# EAGLE design SAS_rev04 (EAGLE 7.5.0)

## Sheet 1 of 2
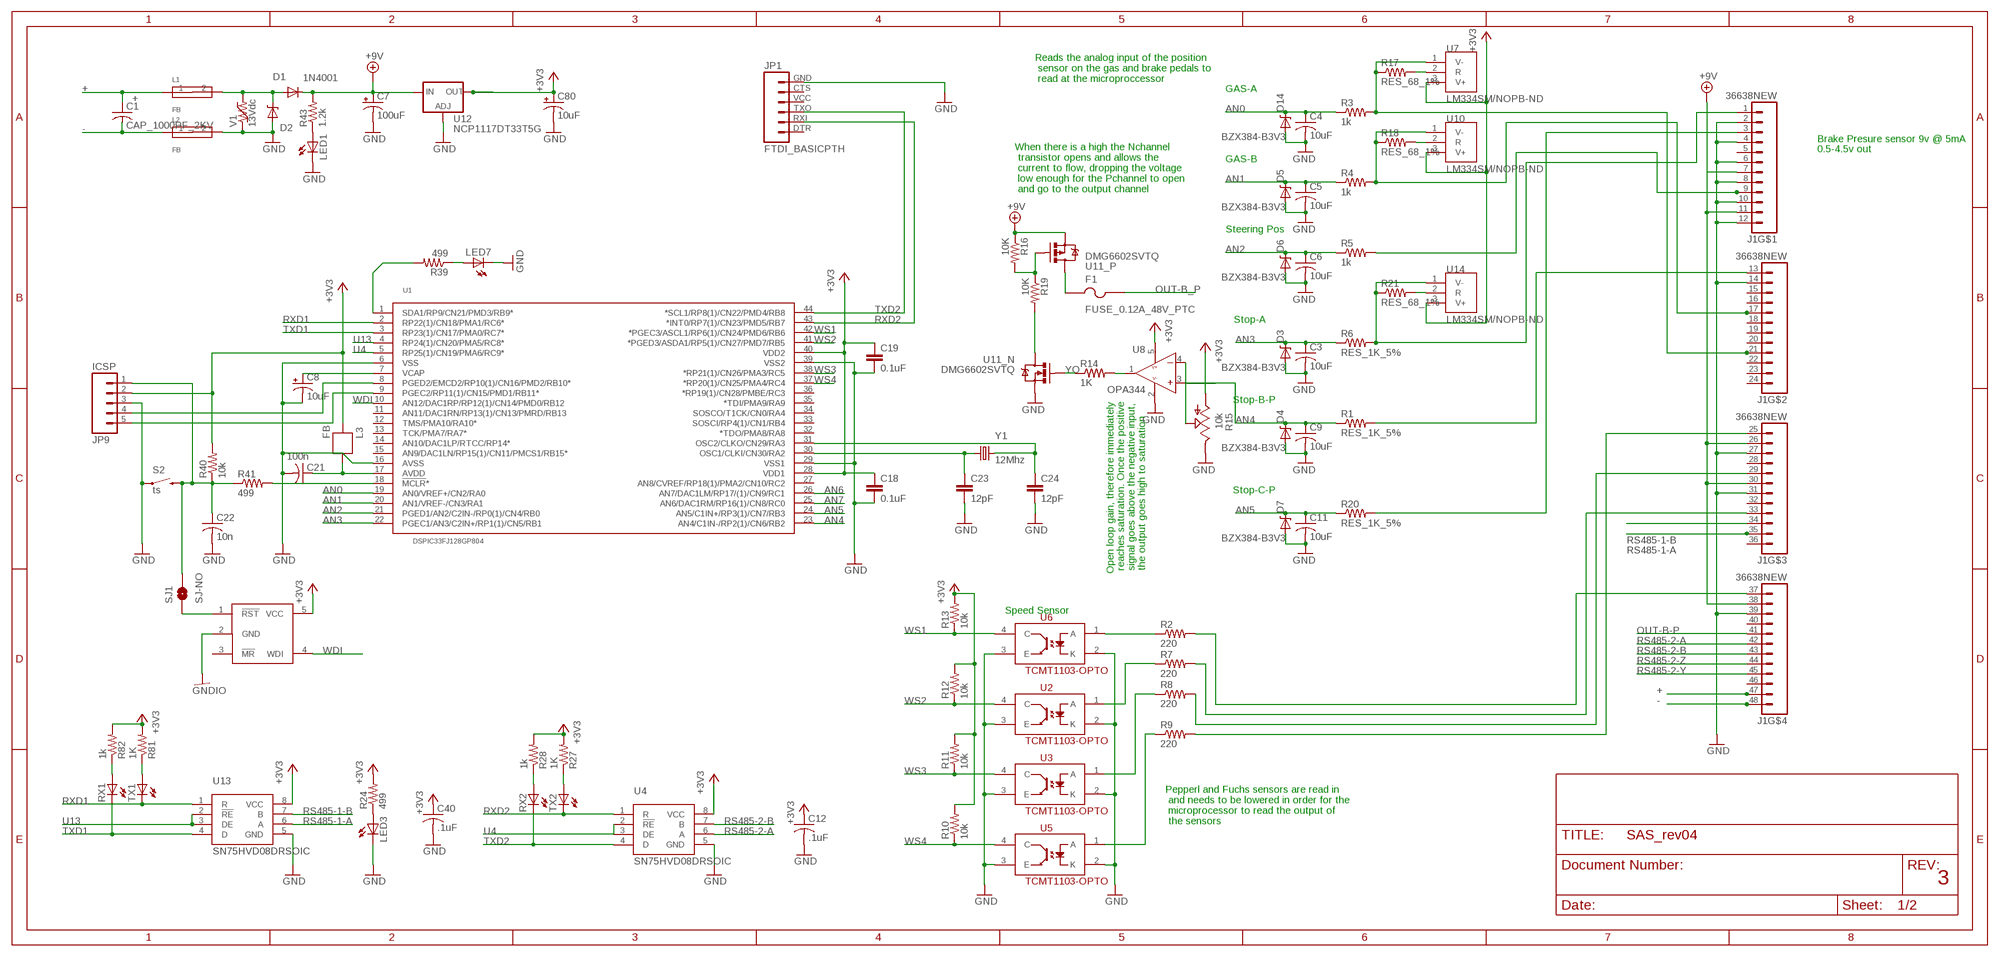
[diagram p0: schematic, sheet 1]

### Parts
C1  CAP_1000PF_2KV  [C1825]
C3  10uF  C-USC0805  [C0805]
C4  10uF  C-USC0805  [C0805]
C5  10uF  C-USC0805  [C0805]
C6  10uF  C-USC0805  [C0805]
C7  100uF  CAP_POL7343  [EIA7343]
C8  10uF  CAP-POL_10UF_16V  [EIA3216-16V]
C9  10uF  C-USC0805  [C0805]
C11  10uF  C-USC0805  [C0805]
C12  .1uF  CAP_0.1UF_50V  [0603]
C18  0.1uF  CAP0805  [0805]
C19  0.1uF  CAP0805  [0805]
C21  100n  C-USC0805  [C0805]
C22  10n  CAP_10NF_50V  [0603]
C23  12pF  CAP0805  [0805]
C24  12pF  CAP0805  [0805]
C40  .1uF  CAP_0.1UF_50V  [0603]
C80  10uF  POLCAP  [POLC1206]
D1  1N4001  DIODE-SOD123  [SOD123]
D2  MM5Z30  [SOD-523F]
D3  BZX384-B3V3  DIODE-ZENER-BZT52  [SOD-323]
D4  BZX384-B3V3  DIODE-ZENER-BZT52  [SOD-323]
D5  BZX384-B3V3  DIODE-ZENER-BZT52  [SOD-323]
D6  BZX384-B3V3  DIODE-ZENER-BZT52  [SOD-323]
D7  BZX384-B3V3  DIODE-ZENER-BZT52  [SOD-323]
D14  BZX384-B3V3  DIODE-ZENER-BZT52  [SOD-323]
F1  FUSE_0.12A_48V_PTC  [1206]
J1  36638NEW  [36638-M]
JP1  FTDI_BASICPTH  [FTDI_BASIC]
JP9  ICSP  M05LOCK_LONGPADS  [1X05_LOCK_LONGPADS]
L1  FB  FERITEBEAD  [0603]
L2  FB  FERITEBEAD  [0603]
L3  FB  [0603]
LED1  LEDCHIP-LED0805  [CHIP-LED0805]
LED3  LEDCHIP-LED0805  [CHIP-LED0805]
LED7  LEDCHIP-LED0805  [CHIP-LED0805]
R1  RES_1K_5%  [0603]
R2  220  RES_220_1%  [0603]
R3  1k  RES_1K_5%  [0603]
R4  1k  RES_1K_5%  [0603]
R5  1k  RES_1K_5%  [0603]
R6  RES_1K_5%  [0603]
R7  220  RES_220_1%  [0603]
R8  220  RES_220_1%  [0603]
R9  220  RES_220_1%  [0603]
R10  10k  RES_10K_1%  [0603]
R11  10k  RES_10K_1%  [0603]
R12  10k  RES_10K_1%  [0603]
R13  10k  RES_10K_1%  [0603]
R14  1K  RES_1K_1%_0805  [0805]
R15  10k  POT_10K_POT  [PVG3]
R16  10K  RES_10K_1%_0805  [0805]
R17  RES_68_1%  [0603]
R18  RES_68_1%  [0603]
R19  10K  RES_10K_1%_0805  [0805]
R20  RES_1K_5%  [0603]
R21  RES_68_1%  [0603]
R24  499  RES_499_1%  [0603]
R27  1K  RES_1K_1%_0805  [0805]
R28  1k  RES_1K_1%_0805  [0805]
R39  499  RES_499_1%  [0603]
R40  10k  RES_10K_1%_0805  [0805]
R41  499  RES_499_1%_0805  [0805]
R43  1.2k  RES_1.2K_1%_0805  [0805]
R81  1K  RES_1K_5%  [0603]
R82  1k  RES_1K_5%  [0603]
RX1  LEDCHIPLED_0805  [CHIPLED_0805]
RX2  LEDCHIPLED_0805  [CHIPLED_0805]
S2  ts  SWITCH-MOMENTARY-2PTH  [TACTILE-PTH]
SJ1  SJ-NO  SOLDERJUMPERNO  [SJ_2S-NO]
TX1  LEDCHIPLED_0805  [CHIPLED_0805]
TX2  LEDCHIPLED_0805  [CHIPLED_0805]
U1  DSPIC33FJ128GP804  [TQFP-44]
U2  TCMT1103-OPTO  [SSOP-4]
U3  TCMT1103-OPTO  [SSOP-4]
U4  SN75HVD08DRSOIC  [SO-8]
U5  TCMT1103-OPTO  [SSOP-4]
U6  TCMT1103-OPTO  [SSOP-4]
U7  LM334SM/NOPB-ND  [SO-8]
U8  OPA344  [SOT23-5]
U9  MAX823  [SOT23-5L]
U10  LM334SM/NOPB-ND  [SO-8]
U11  DMG6602SVTQ  [SOT23-6]
U12  NCP1117DT33T5G  V_REG_317DPACK  [V-REG_DPACK]
U13  SN75HVD08DRSOIC  [SO-8]
U14  LM334SM/NOPB-ND  [SO-8]
V1  13Vdc  VAR-RES  [0603]
Y1  12Mhz  CRYSTAL5X3  [CRYSTAL-SMD-5X3]

### Nets
+: C1.1(+) J1.47 L1.1
+3V3: C12.1(+) C18.1 C19.1 C40.1(+) C80.1(+) JP9.2 L3.2 R10.2 R11.2 R12.2 R13.2 R15.1(CW) R24.2 R27.2 R28.2 R40.2 R81.2 R82.2 U1.28(VDD1) U1.40(VDD2) U4.8(VCC) U7.3(V+) U8.5(V+) U9.5(VCC) U10.3(V+) U12.4(OUT) U13.8(VCC) U14.3(V+)
+9V: C7.A(+) D1.C J1.7 J1.11 J1.26 J1.30 J1.38 R16.1 R43.2 U11.2(_P:S) U12.3(IN)
-: C1.2(-) J1.48 L2.1
AN0: C4.1 D14.1(C) R3.1 U1.19(AN0/VREF+/CN2/RA0)
AN1: C5.1 D5.1(C) R4.1 U1.20(AN1/VREF-/CN3/RA1)
AN2: C6.1 D6.1(C) R5.1 U1.21(PGED1/AN2/C2IN-/RP0(1)/CN4/RB0)
AN3: C3.1 D3.1(C) R6.1 U1.22(PGEC1/AN3/C2IN+/RP1(1)/CN5/RB1)
AN4: C9.1 D4.1(C) R1.1 U1.23(AN4/C1IN-/RP2(1)/CN6/RB2) U8.3(+)
AN5: C11.1 D7.1(C) R20.1 U1.24(AN5/C1IN+/RP3(1)/CN7/RB3)
AN6: U1.26(AN7/DAC1LM/RP17/(1)/CN9/RC1)
AN7: U1.25(AN6/DAC1RM/RP16(1)/CN8/RC0)
GHT: D1.A D2.C L1.2 V1.2
GND: C3.2 C4.2 C5.2 C6.2 C7.C(-) C8.C(-) C9.2 C11.2 C12.2(-) C18.2 C19.2 C21.2 C22.2(-) C23.2 C24.2 C40.2(-) C80.2(-) D2.A D3.2(A) D4.2(A) D5.2(A) D6.2(A) D7.2(A) D14.2(A) J1.2 J1.4 J1.6 J1.8 J1.10 J1.12 J1.14 J1.27 J1.31 J1.39 JP1.GND JP9.3 L2.2 LED1.C LED3.C LED7.C R15.3(CCW) S2.1 U1.6(VSS) U1.16(AVSS) U1.29(VSS1) U1.39(VSS2) U2.2(K) U2.3(E) U3.2(K) U3.3(E) U4.5(GND) U5.2(K) U5.3(E) U6.2(K) U6.3(E) U8.2(V-) U11.5(_N:S) U12.1(ADJ) U13.5(GND) V1.1
GNDIO: U9.2(GND)
N$1: C22.1(+) JP9.1 R40.1 R41.1 S2.3 SJ1.2
N$2: C21.1 L3.1 U1.17(AVDD)
N$3: J1.21 R3.2 R17.1 U7.1(V-)
N$4: C8.A(+) U1.7(VCAP)
N$5: R39.2 U1.1(SDA1/RP9/CN21/PMD3/RB9*)
N$6: LED1.A R43.1
N$7: R17.2 U7.2(R)
N$8: R41.2 U1.18(!MCLR!*)
N$9: R15.2(W) U8.4(-)
N$10: SJ1.1 U9.1(!RST)
N$11: J1.37 R2.2
N$12: JP9.4 U1.8(PGED2/EMCD2/RP10(1)/CN16/PMD2/RB10*)
N$15: JP9.5 U1.9(PGEC2/RP11(1)/CN15/PMD1/RB11*)
N$16: J1.33 R7.2
N$17: J1.29 R8.2
N$18: J1.25 R9.2
N$19: R2.1 U6.1(A)
N$20: R7.1 U2.1(A)
N$21: R8.1 U3.1(A)
N$22: R9.1 U5.1(A)
N$24: R18.2 U10.2(R)
N$25: LED3.A R24.1
N$28: J1.17 R4.2 R18.1 U10.1(V-)
N$29: J1.9 R5.2
N$31: R27.1 TX2.A
N$32: R28.1 RX2.A
N$34: R14.2 U8.1(O)
N$37: LED7.A R39.1
N$39: C24.1 U1.31(OSC2/CLKO/CN29/RA3) Y1.3
N$40: C23.1 U1.30(OSC1/CLKI/CN30/RA2) Y1.1
N$42: R19.2 U11.6(_N:D)
N$44: R16.2 R19.1 U11.3(_P:G)
N$45: F1.1 U11.4(_P:D)
N$50: R21.2 U14.2(R)
N$86: R81.1 TX1.A
N$87: R82.1 RX1.A
OUT-B-P: J1.41
OUT-B_P: F1.2
RS485-1-A: J1.35 U13.6(A)
RS485-1-B: J1.34 U13.7(B)
RS485-2-A: J1.42 U4.6(A)
RS485-2-B: J1.43 U4.7(B)
RS485-2-Y: J1.45
RS485-2-Z: J1.44
RXD1: TX1.C U1.2(RP22(1)/CN18/PMA1/RC6*) U13.1(R)
RXD2: JP1.RXI TX2.C U1.43(*INT0/RP7(1)/CN23/PMD5/RB7) U4.1(R)
STOP-A: J1.1 R6.2 R21.1 U14.1(V-)
STOP-B: J1.13 R1.2
STOP-C: J1.3 R20.2
TXD1: RX1.C U1.3(RP23(1)/CN17/PMA0/RC7*) U13.4(D)
TXD2: JP1.TXO RX2.C U1.44(*SCL1/RP8(1)/CN22/PMD4/RB8) U4.4(D)
U4: U1.5(RP25(1)/CN19/PMA6/RC9*) U4.2(!RE) U4.3(DE)
U13: U1.4(RP24(1)/CN20/PMA5/RC8*) U13.2(!RE) U13.3(DE)
WDI: U1.10(AN12/DAC1RP/RP12(1)/CN14/PMD0/RB12) U9.4(WDI)
WS1: R13.1 U1.42(*PGEC3/ASCL1/RP6(1)/CN24/PMD6/RB6) U6.4(C)
WS2: R12.1 U1.41(*PGED3/ASDA1/RP5(1)/CN27/PMD7/RB5) U2.4(C)
WS3: R11.1 U1.38(*RP21(1)/CN26/PMA3/RC5) U3.4(C)
WS4: R10.1 U1.37(*RP20(1)/CN25/PMA4/RC4) U5.4(C)
YO: R14.1 U11.1(_N:G)
Unconnected: J1.5 J1.15 J1.16 J1.18 J1.19 J1.20 J1.22 J1.23 J1.24 J1.28 J1.32 J1.36 J1.40 J1.46 JP1.CTS JP1.DTR JP1.VCC U1.11(AN11/DAC1RN/RP13(1)/CN13/PMRD/RB13) U1.12(TMS/PMA10/RA10*) U1.13(TCK/PMA7/RA7*) U1.14(AN10/DAC1LP/RTCC/RP14*) U1.15(AN9/DAC1LN/RP15(1)/CN11/PMCS1/RB15*) U1.27(AN8/CVREF/RP18(1)/PMA2/CN10/RC2) U1.32(*TDO/PMA8/RA8) U1.33(SOSCI/RP4(1)/CN1/RB4) U1.34(SOSCO/T1CK/CN0/RA4) U1.35(*TDI/PMA9/RA9) U1.36(*RP19(1)/CN28/PMBE/RC3) U9.3(!MR)

### Notes on the sheet
- Reads the analog input of the position
   sensor on the gas and brake pedals to
   read at the microproccessor
- GAS-A
- Brake Presure sensor 9v @ 5mA
- 0.5-4.5v out
- GAS-B
- When there is a high the Nchannel
   transistor opens and allows the
   current to flow, dropping the voltage
   low enough for the Pchannel to open
   and go to the output channel
- Steering Pos
- Stop-A
- Stop-B-P
- Stop-C-P
- Open loop gain, therefore immediately
   reaches saturation. Once the positive
   signal goes above the negative input,
   the output goes high to saturation
- Speed Sensor
- Pepperl and Fuchs sensors are read in
   and needs to be lowered in order for the
   microprocessor to read the output of
   the sensors
- 3

## Sheet 2 of 2

## Library data of the parts
C1 = FSAE Electric:CAP; PARTNO: 1825GC102KAT1A
C3-C6 C9 C11 C21 = adafruit:C-US: CAPACITOR, American symbol
C7 = SparkFun-Capacitors:CAP_POL: Capacitor Polarized These are standard SMD and PTH capacitors. Normally 10uF, 47uF, and 100uF in electrolytic and tantalum varieties. Always verify the external diameter of the through hole cap, it varies with capacity, voltage, and manufacturer. The EIA devices should be standard.
C8 = FSAE Electric:CAP-POL; PARTNO: T491A106M016AT
C12 C40 = FSAE Electric:CAP; PARTNO: CC0603ZRY5V9BB104
C18 C19 C23 C24 = SparkFun-Capacitors:CAP: Capacitor Standard 0603 ceramic capacitor, and 0.1" leaded capacitor.
C22 = FSAE Electric:CAP; PARTNO: CL10F103ZB8NNNC
C80 = RJ's_parts:POLCAP
D1 = diode:DIODE-: DIODE
D2 = EmEndev:MM5Z30
D3-D7 D14 = SparkFun:DIODE-ZENER: Zener Diode Production Part - 8199 3.4V Zener Voltage
F1 = FSAE Electric:FUSE; PARTNO: 0ZCJ0012FF2E
J1 = FSAE Electric:36638
JP1 = SparkFun-Connectors:FTDI_BASIC: FTDI Basic header with labels
JP9 = SparkFun-Connectors:M05: Header 5 Standard 5-pin 0.1" header. Use with straight break away headers (SKU : PRT-00116), right angle break away headers (PRT-00553), swiss pins (PRT-00743), machine pins (PRT-00117), and female headers (PRT-00115). Molex polarized connector foot print use with SKU : PRT-08230 with associated crimp pins and housings.
L1 L2 = EmEndev:FERITEBEAD
L3 = SparkFun-Passives:FB
LED1 LED3 LED7 RX1 RX2 TX1 TX2 = adafruit:LED: LED OSRAM: - CHIPLED LG R971, LG N971, LY N971, LG Q971, LY Q971, LO R971, LY R971 LH N974, LH R974 LS Q976, LO Q976, LY Q976 LO Q996 - Hyper CHIPLED LW Q18S LB Q993, LB Q99A, LB R99A - SideLED LS A670, LO A670, LY A670, LG A670, LP A670 LB A673, LV A673, LT A673, LW A673 LH A674 LY A675 LS A676, LA A676, LO A676, LY A676, LW A676 LS A679, LY A679, LG A679 - Hyper Micro SIDELED® LS Y876, LA Y876, LO Y876, LY Y876 LT Y87S - SmartLED LW L88C, LW L88S LB L89C, LB L89S, LG L890 LS L89K, LO L89K, LY L89K LS L896, LA L896, LO L896, LY L896 - TOPLED LS T670, LO T670, LY T670, LG T670, LP T670 LSG T670, LSP T670, LSY T670, LOP T670, LYG T670 LG T671, LOG T671, LSG T671 LB T673, LV T673, LT T673, LW T673 LH T674 LS T676, LA T676, LO T676, LY T676, LB T676, LH T676, LSB T676, LW T676 LB T67C, LV T67C, LT T67C, LS T67K, LO T67K, LY T67K, LW E67C LS E67B, LA E67B, LO E67B, LY E67B, LB E67C, LV E67C, LT E67C LW T67C LS T679, LY T679, LG T679 LS T770, LO T770, LY T770, LG T770, LP T770 LB T773, LV T773, LT T773, LW T773 LH T774 LS E675, LA E675, LY E675, LS T675 LS T776, LA T776, LO T776, LY T776, LB T776 LHGB T686 LT T68C, LB T68C - Hyper Mini TOPLED® LB M676 - Mini TOPLED Santana® LG M470 LS M47K, LO M47K, LY M47K Source: http://www.osram.convergy.de/
R1 R3-R6 R20 R81 R82 = FSAE Electric:RES: Resistors; PARTNO: RC0603JR-071KL
R2 R7-R9 = FSAE Electric:RES: Resistors; PARTNO: RC0603FR-07220RL
R10-R13 = FSAE Electric:RES: Resistors; PARTNO: RC0603FR-0710KL
R14 = FSAE Electric:RES: Resistors; PARTNO: RC0805FR-071KL
R15 = FSAE Electric:POT; PARTNO: PVG3A103C01R00
R16 R19 = FSAE Electric:RES: Resistors; PARTNO: RC0805FR-0710KL
R17 R18 R21 = FSAE Electric:RES: Resistors; PARTNO: CRCW060368R0FKEA
R24 R39 = FSAE Electric:RES: Resistors; PARTNO: RC0603FR-07499RL
R27 R28 = FSAE Eletric:RES; PARTNO: RC0805FR-071KL
R40 = FSAE Eletric:RES; PARTNO: RC0805FR-0710KL
R41 = FSAE Eletric:RES; PARTNO: RC0805FR-07499RL
R43 = FSAE Electric:RES: Resistors; PARTNO: RC0805FR-071K2L
S2 = SparkFun-Electromechanical:SWITCH-MOMENTARY-2: Various NO switches- pushbuttons, reed, etc
SJ1 = SparkFun-Passives:SOLDERJUMPER: Solder Jumper Standard SMD solder jumper. Used to automate production. Two varients : Normally Open and Normally Closed are the same, but have different paste layers. NC will have a large amount of paste and should jumper during reflow.
U1 = FSAE Electric:DSPIC33FJ128GP804; PARTNO: DSPIC33FJ128GP804-I/PT
U2 U3 U5 U6 = SparkFun-DiscreteSemi:TCMT1103-OPTO: Optoisolator- NPN output
U4 U13 = FSAE Electric:SN75HVD08DR; PARTNO: SN75176BDR
U7 U10 U14 = FSAE Electric:LM334: Current Source IC 3% 8-SO View on DigiKey <http://www.digikey.com/product-detail/en/LM334SM%2FNOPB/LM334SM%2FNOPB-ND/363905>; PARTNO: LM334SM/NOPB-ND
U8 = FSAE Electric:OPA344; PARTNO: OPA344NA/3K
U9 = NASA_LIB:MAX823
U11 = FSAE Electric:DMG6602SVTQ: DMG6602SVTQ-7 MOSFET N/P-CH 30V; PARTNO: DMG6602SVTQ-7
U12 = SparkFun-PowerIC:V_REG_317: Voltage Regulator Standard LM317 adjustable voltage regulator. AOI (Adjust Output Input). Google 'LM317 Calculator' for easy to use app to get the two resistor values needed. 240/720 for 5V output. 240/390 for 3.3V output. Spark Fun Electronics SKU : COM-00527
V1 = EmEndev:VAR-RES
Y1 = SparkFun-FreqCtrl:CRYSTAL: Various standard crystals. Proven footprints. Spark Fun Electronics SKU : COM-00534

## Board
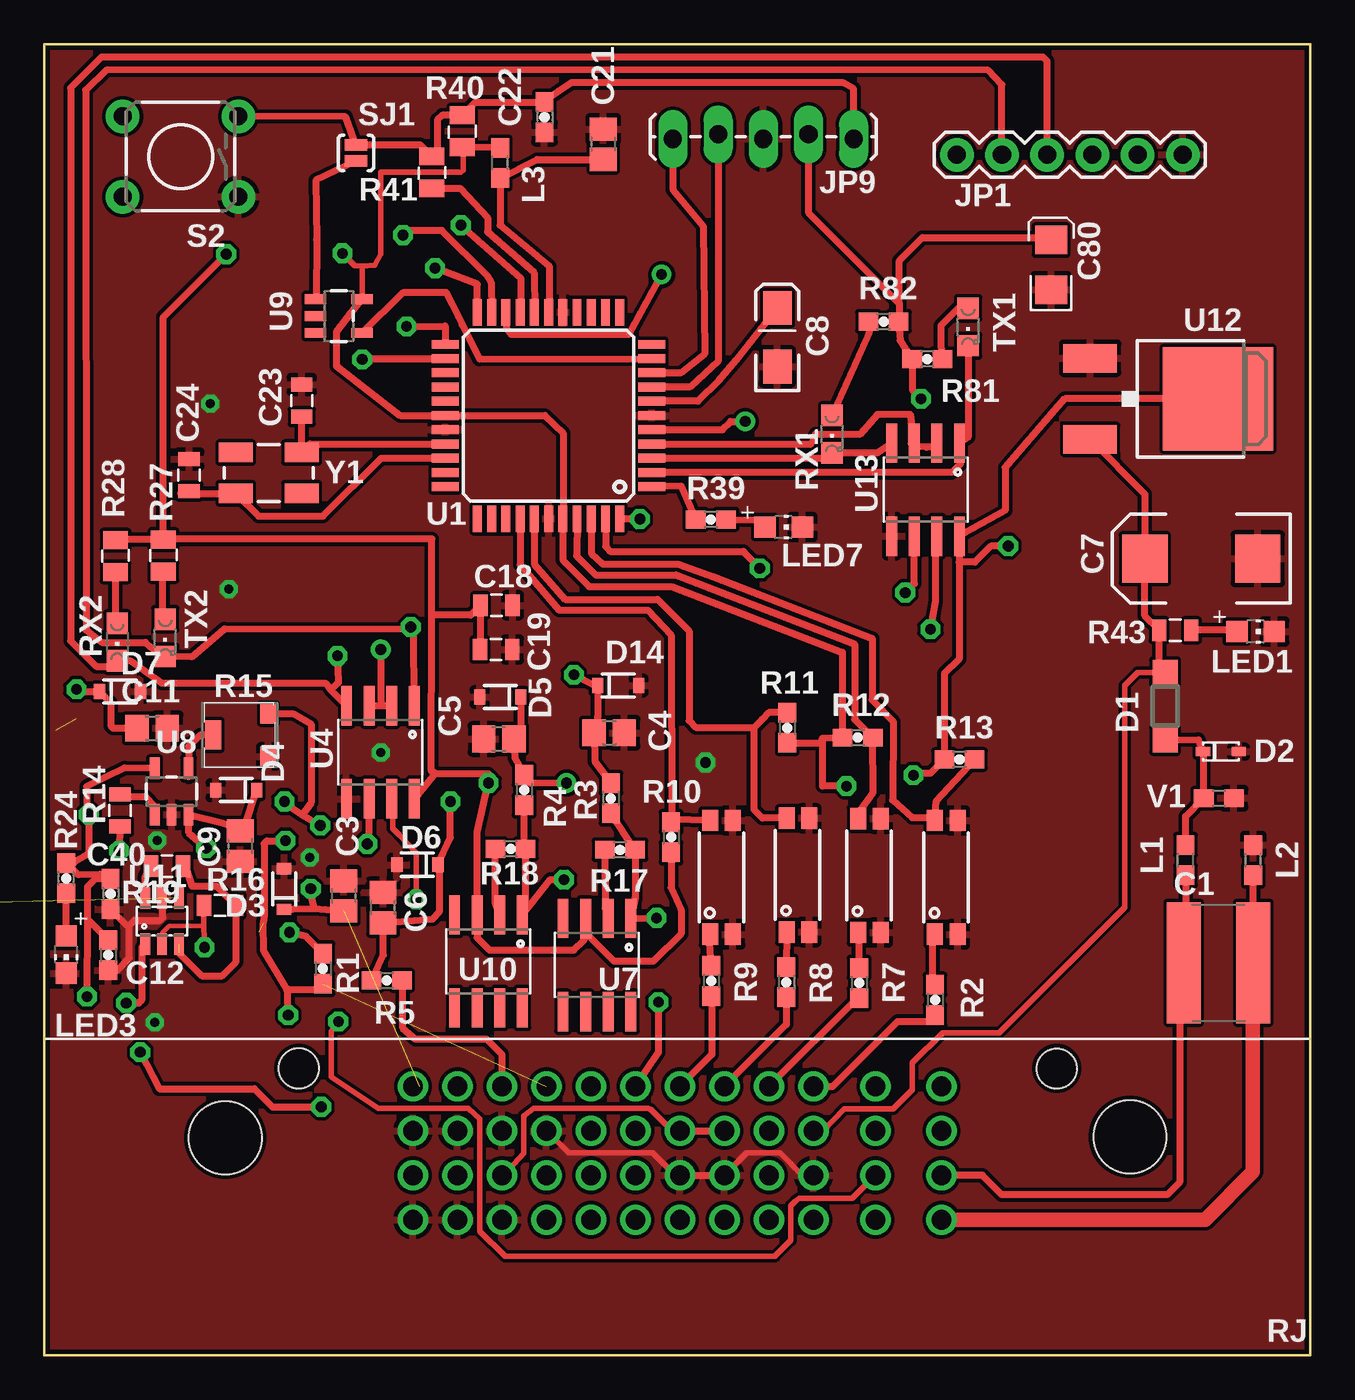
[diagram p1: board, top side]
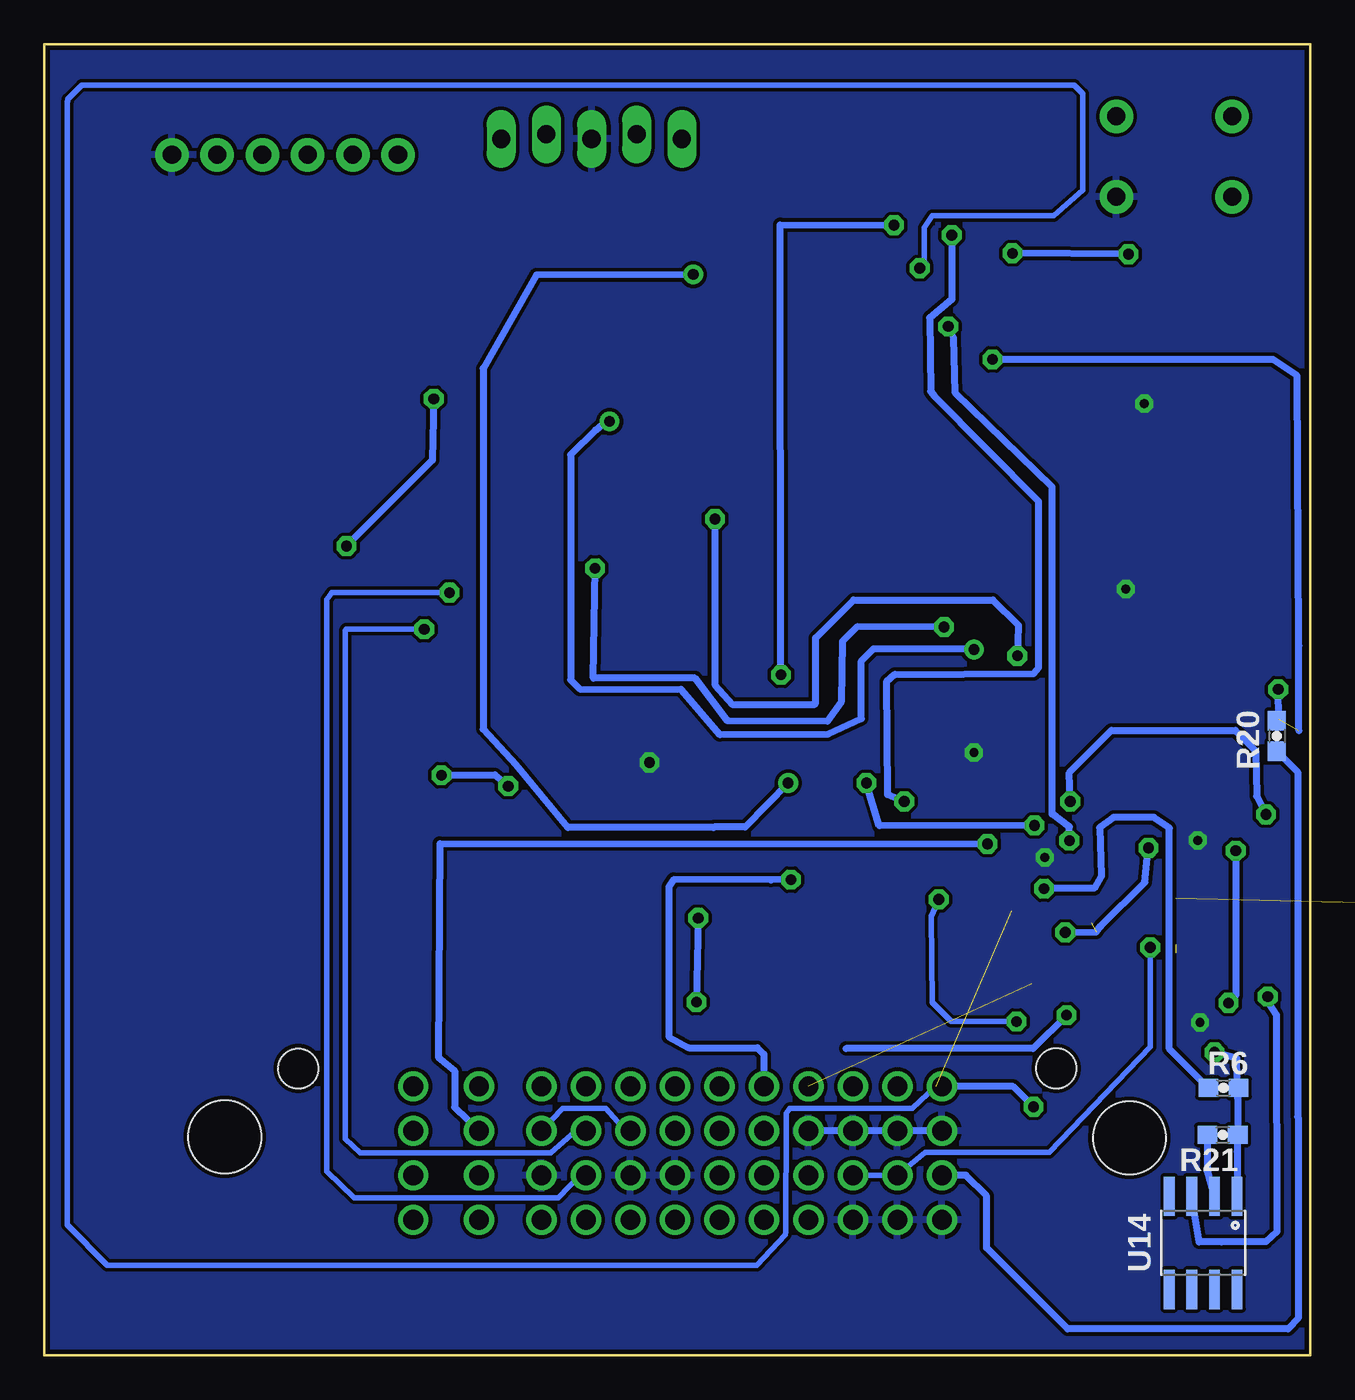
[diagram p2: board, bottom side, seen from below]

Size 71.12 x 73.66 mm. Coordinates in mm from the lower left corner, seen from the top.
Copper layers (1*16): Top 0.035mm / dielectric 1.5mm / Bottom 0.035mm
Design rules "SparkFun": minimum track width 8mil, minimum drill 20mil, track to track 8mil, track to pad 8mil, pad to pad 8mil, via to via 8mil, smd to smd 8mil, copper to edge 10mil, drill to drill 8mil, minimum pad ring 12mil, minimum via ring 10mil, stop-mask expansion 4mil, vias tented up to drill 25mil, thermal gap 10mil

### Footprints (pad centres in the part's own frame; a part is rotated, then mirrored left to right if it is on the bottom)
C1825 = smd 6.8 x 1.9: 1 0,-1.95; 2 0,1.95
C0805 = smd 1.3 x 1.5: 1 -0.85,0; 2 0.85,0
EIA7343 = smd 2.55 x 2.7: A 3.17,0; C -3.17,0
EIA3216-16V = smd 1.9 x 1.6: A 1.65,0; C -1.65,0
0603 = smd 1.1 x 1: 1 -0.85,0; 2 0.85,0
0805 = smd 0.8 x 1.2: 1 -0.9,0; 2 0.9,0
POLC1206 = smd 1.6 x 1.8: 1 -1.4,0; 2 1.4,0
SOD123 = smd 1.4 x 1.4: A 1.9,0; C -1.9,0
SOD-523F = smd 0.8 x 0.5: A -1,0; C 1,0
SOD-323 = smd 0.63 x 0.83: 1 -1.15,0; 2 1.15,0
1206 = smd 1.6 x 1.8: 1 -1.4,0; 2 1.4,0
36638-M = drill 1.1: 1 20.7,15.1; 2 20.7,12.6; 3 20.7,10.1; 4 20.7,7.6; 5 23.2,15.1; 6 23.2,12.6; 7 23.2,10.1; 8 23.2,7.6; 9 25.7,15.1; 10 25.7,12.6; 11 25.7,10.1; 12 25.7,7.6; 13 28.2,15.1; 14 28.2,12.6; 15 28.2,10.1; 16 28.2,7.6; 17 30.7,15.1; 18 30.7,12.6; 19 30.7,10.1; 20 30.7,7.6; 21 33.2,15.1; 22 33.2,12.6; 23 33.2,10.1; 24 33.2,7.6; 25 35.7,15.1; 26 35.7,12.6; 27 35.7,10.1; 28 35.7,7.6; 29 38.2,15.1; 30 38.2,12.6; 31 38.2,10.1; 32 38.2,7.6; 33 40.7,15.1; 34 40.7,12.6; 35 40.7,10.1; 36 40.7,7.6; 37 43.2,15.1; 38 43.2,12.6; 39 43.2,10.1; 40 43.2,7.6; 41 46.7,15.1; 42 46.7,12.6; 43 46.7,10.1; 44 46.7,7.6; 45 50.4,15.1; 46 50.4,12.6; 47 50.4,10.1; 48 50.4,7.6 | hole 2.25: 56.87,16.1; 14.28,16.12 | hole 4.1: 60.99,12.26; 10.16,12.21
FTDI_BASIC = drill 1.016 pad 1.88: CTS 10.16,0; DTR 0,0; GND 12.7,0; RXI 2.54,0; TXO 5.08,0; VCC 7.62,0
1X05_LOCK_LONGPADS = drill 1.016 long: 1 0,0; 2 2.54,-0.254; 3 5.08,0; 4 7.62,-0.254; 5 10.16,0
CHIP-LED0805 = smd 1.2 x 1.2: A 0,-1.05; C 0,1.05
PVG3 = smd 1.1 x 0.9: 1 1.2,-1.5; 3 -1.2,-1.5 | smd 1.65 x 0.9: 2 0,1.6
0805' = smd 1 x 1.4: 1 -0.9,0; 2 0.9,0
CHIPLED_0805 = smd 1.2 x 1.2: A 0,-1.05; C 0,1.05
TACTILE-PTH = drill 1.016 pad 1.88: 1 -3.251,2.261; 2 3.251,2.261; 3 -3.251,-2.261; 4 3.251,-2.261
SJ_2S-NO = smd 0.635 x 1.27: 1 -0.45,0; 2 0.45,0
TQFP-44 = smd 1.5 x 0.5: 1 -5.8,4; 2 -5.8,3.2; 3 -5.8,2.4; 4 -5.8,1.6; 5 -5.8,0.8; 6 -5.8,0; 7 -5.8,-0.8; 8 -5.8,-1.6; 9 -5.8,-2.4; 10 -5.8,-3.2; 11 -5.8,-4; 23 5.8,-4; 24 5.8,-3.2; 25 5.8,-2.4; 26 5.8,-1.6; 27 5.8,-0.8; 28 5.8,0; 29 5.8,0.8; 30 5.8,1.6; 31 5.8,2.4; 32 5.8,3.2; 33 5.8,4 | smd 0.5 x 1.5: 12 -4,-5.8; 13 -3.2,-5.8; 14 -2.4,-5.8; 15 -1.6,-5.8; 16 -0.8,-5.8; 17 0,-5.8; 18 0.8,-5.8; 19 1.6,-5.8; 20 2.4,-5.8; 21 3.2,-5.8; 22 4,-5.8; 34 4,5.8; 35 3.2,5.8; 36 2.4,5.8; 37 1.6,5.8; 38 0.8,5.8; 39 0,5.8; 40 -0.8,5.8; 41 -1.6,5.8; 42 -2.4,5.8; 43 -3.2,5.8; 44 -4,5.8
SSOP-4 = smd 1.2 x 0.9: 1 -3.2,0.67; 2 -3.2,-0.6; 3 3.2,-0.6; 4 3.2,0.67
SO-8 = smd 0.61 x 2.21: 1 -1.905,-2.616; 2 -0.635,-2.616; 3 0.635,-2.616; 4 1.905,-2.616; 5 1.905,2.616; 6 0.635,2.616; 7 -0.635,2.616; 8 -1.905,2.616
SOT23-5 = smd 0.55 x 1.2: 1 -0.95,-1.3; 2 0,-1.3; 3 0.95,-1.3; 4 0.95,1.3; 5 -0.95,1.3
SOT23-5L = smd 0.55 x 1.2: 1 -0.95,-1.3; 2 0,-1.3; 3 0.95,-1.3; 4 0.95,1.3; 5 -0.95,1.3
SOT23-6 = smd 0.55 x 1.2: 1 -0.95,-1.3; 2 0,-1.3; 3 0.95,-1.3; 4 0.95,1.3; 5 0,1.3; 6 -0.95,1.3
V-REG_DPACK = smd 1.6 x 3: 1 -2.28,-4.8; 3 2.28,-4.8 | smd 5.8 x 6.2: 4 0,2.38
CRYSTAL-SMD-5X3 = smd 1.9 x 1.1: 1 -1.85,-1.15; 2 1.85,-1.15; 3 1.85,1.15; 4 -1.85,1.15

### Placement (x,y rotation side)
C1  65.96,22.05 270 top
C3  16.81,25.81 90 top
C4  31.72,34.98 0 top
C5  25.53,34.62 180 top
C6  19.02,25.15 90 top
C7  65,44.75 180 top
C8  41.17,57.2 90 top
C9  11,28.6 270 top
C11  6.05,35.23 0 top
C12  3.58,22.48 270 top
C18  25.4,42.14 0 top
C19  25.37,39.65 0 top
C21  31.39,68.05 90 top
C22  28.09,69.57 270 top
C23  14.45,53.64 90 top
C24  8.13,49.45 90 top
C40  3.71,25.91 270 top
C80  56.56,61.27 270 top
D1  62.96,36.47 270 top
D2  66.09,33.91 180 top
D3  13.46,26.19 90 top
D4  10.77,31.75 180 top
D5  25.6,36.98 180 top
D6  20.95,27.56 180 top
D7  4.24,37.29 0 top
D14  32.23,37.63 0 top
F1  -6.53,23.95 270 top  (outside the outline)
J1  0,0 0 top
JP1  51.26,67.46 0 top
JP9  45.47,68.35 180 top
L1  64.11,27.82 90 top
L2  67.91,27.81 90 top
L3  25.6,67.01 90 top
LED1  68.05,40.67 270 top
LED3  1.22,22.5 180 top
LED7  41.53,46.53 270 top
R1  15.65,21.72 270 top
R2  50.04,19.96 270 top
R3  31.83,31.29 270 top
R4  26.95,31.75 270 top
R5  19.23,21.06 0 top
R6  4.88,15.01 0 bottom
R7  45.77,20.9 270 top
R8  41.68,20.95 270 top
R9  37.46,21.03 270 top
R10  35.2,29.11 270 top
R11  41.73,35.26 270 top
R12  45.69,34.7 180 top
R13  51.41,33.48 180 top
R14  4.24,30.61 90 top
R15  11.07,34.85 90 top
R16  9.86,25.27 0 top
R17  32.33,28.4 180 top
R18  26.19,28.45 180 top
R19  6.88,27.48 180 top
R20  1.88,34.8 270 bottom
R21  4.93,12.37 180 bottom
R24  1.22,26.8 90 top
R27  1K  [0805']  6.68,44.93 90 top
R28  1k  [0805']  3.99,44.91 90 top
R39  37.44,46.96 180 top
R40  10k  [0805']  23.47,68.78 270 top
R41  499  [0805']  21.77,66.47 270 top
R43  63.54,40.74 180 top
R81  49.61,55.98 180 top
R82  47.14,58.09 0 top
RX1  44.25,51.77 180 top
RX2  4.09,40.08 180 top
S2  7.65,67.36 180 top
SJ1  17.5,67.56 90 top
TX1  51.89,57.79 180 top
TX2  6.78,40.31 180 top
U1  28.32,52.81 180 top
U2  46.38,26.95 90 top
U3  42.37,26.97 90 top
U4  18.87,33.88 180 top
U5  38.07,26.85 90 top
U6  50.7,26.85 90 top
U7  31.04,21.92 180 top
U8  7.14,31.67 0 top
U9  16.54,58.39 270 top
U10  24.94,22.12 180 top
U11  6.6,24.38 0 top
U12  63.55,53.75 270 top
U13  49.5,48.64 180 top
U14  6.02,6.3 180 bottom
V1  65.98,31.3 180 top
Y1  12.6,49.58 180 top

### Tracks (layer width: path | path; a pad name or v marks a point on that pad's centre or on a via)
+
  Top 0.406: L1.1 64.11,22.15 C1.1 63.78,21.81 63.78,9.7 63.09,9.02 53.77,9.02 52.69,10.1 J1.47
+3V3  (via drill 0.6)
  Top 0.305: 23.53,67.83 R40.2 23.52,67.83 23.52,66.6 23.39,66.47 18.9,66.47 18.9,61.87 18.57,61.27 17.84,61.21 | 17.84,61.21 17.84,59.88 17.84,59.38 U9.5 | 17.84,61.21 17.42,61.24 v16.74,61.93
  Top 0.406: L3.2 23.8,67.88 R40.2 | R27.2 3.99,45.83 R28.2 | C19.1 24.49,41.11 C18.1 23.94,41.58 21.76,41.58 | JP9.2 42.93,64.21 48.03,59.11 | 48.03,59.11 48.03,57.54 R82.2 48.07,57.03 R81.2 48.76,54.24 v49.25,53.75 | 48.03,59.11 48.03,61.52 49.33,62.81 56.41,62.81 C80.1 | U12.4 57.33,53.75 56.77,53.11 53.98,49.89 53.98,47.47 U13.8 51.38,44.55 | R27.2 6.68,58.34 v10.21,61.87 | v13.49,31.12 13.62,31.48 13.62,30.93 14.47,30.36 | v54.15,45.47 53.18,45.47 52.27,44.56 51.47,44.56 | R27.2 6.72,45.87 21.77,45.87 21.76,41.58 | 14.47,30.36 v15.49,29.77 | 24.94,32.66 v24.94,32.16 24.31,29.39 U10.3 24.31,23.44 24.99,22.76 29.74,22.76 30.3,23.32 30.3,23.83 | 24.94,32.66 21.95,32.69 21.01,31.5 U4.8 | 24.94,32.66 22.12,32.66 21.74,32.82 21.76,41.58 | 51.38,44.55 51.38,39.12 50.56,38.29 R13.2 49.79,32.7 48.73,32.7 v48.82,32.59 | 51.47,44.56 51.4,44.56 51.38,44.55 | 51.47,44.56 51.44,44.6 | R11.2 43.71,34.39 | 43.71,34.39 43.7,34.67 R12.2 44.83,34.86 44.83,39.5 35.23,43.18 30.61,43.18 29.12,44.69 U1.40 29.13,47.1 29.13,51.82 28.12,52.81 U1.28 19.99,52.81 16.41,55.58 16.41,57.51 U9.5 | v45.06,31.98 43.71,31.98 43.71,34.39 | 30.3,23.83 30.3,25.04 U7.3 | R15.1 13.96,36.05 14.99,35.46 14.99,31.05 14.47,30.36 | R10.2 35.2,26.26 35.76,25.02 35.76,23.67 34.21,22.12 32,22.12 30.3,23.83 | 2.41,24.5 2.41,26.31 2.86,26.76 C40.1 3.12,27.01 1.91,26.99 R24.2 1.64,27.68 2.49,28.17 v2.49,30.38 2.36,30.51 2.36,31.95 4.5,33 U8.5 | 2.41,24.5 C12.1 | 2.41,24.5 v2.39,20.14
  Bottom 0.406: v10.21,61.87 v16.74,61.93 | v13.49,31.12 13.54,32.74 11.18,35.1 4.22,35.1 3.07,33.96 3.02,31.42 v2.49,30.38 | v49.25,53.75 49.33,50.29 v54.15,45.47 | v15.49,29.77 24.21,29.74 v24.94,32.16 | v48.82,32.59 45.82,32.61 v45.06,31.98 | v2.39,20.14 2.36,19.81 1.91,19.13 1.88,6.93 2.49,6.38 4.98,6.35 6.25,6.35 U14.3
+9V  (via drill 0.6)
  Top 0.254: U11.2 6.6,23.72 7.01,24.13 8.87,24.13 8.96,24.04
  Top 0.305: 35.28,12.6 34.06,13.82 34.01,13.82 33.93,13.87 27.48,13.87 26.92,13.44 26.92,11.33 25.8,10.1 J1.11 | D1.C 61.43,38.37 60.71,37.64 60.71,25.17 53.64,18.11 50.47,18.11 48.77,16.41 48.77,14.91 47.68,13.84 44.93,13.84 43.72,12.57 43.69,12.6 J1.38 | R16.1 8.96,24.19 8.96,24.04 v8.99,22.91
  Top 0.406: D1.C 62.64,38.7 R43.2 61.83,41.54 C7.A 61.83,48.39 U12.3 | J1.30 J1.26 35.28,12.6
  Bottom 0.305: J1.30 38.46,12.6 39.6,13.87 42.01,13.87 J1.38 | J1.11 J1.7 21.64,11.38 14.66,11.38 8.99,17.32 v8.99,22.91
-
  Top 0.406: C1.2 L2.1
  Top 0.813: J1.48 65.21,7.6 67.89,10.29 67.89,22.03 C1.2
AN0  (via drill 0.6)
  Top 0.406: R3.1 30.93,33.37 C4.1 31.08,35.91 D14.1 30.9,37.63 v29.74,38.23 | v23.39,63.5 26.75,60.53 26.77,58.86 U1.19
  Bottom 0.406: v29.74,38.23 29.79,63.53 v23.39,63.5
AN1  (via drill 0.6)
  Top 0.406: D5.1 26.75,35.28 C5.1 26.43,33.55 R4.1 27.27,32.13 v29.34,32.16 | U1.20 25.95,57.7 26.21,57.38 32.84,57.38 v34.67,60.73
  Bottom 0.406: v34.67,60.73 43.48,60.71 46.48,55.45 46.48,35.18 44.65,33.2 41.71,29.64 33.53,29.64 33.5,29.67 31.75,29.67 v29.34,32.16
AN2  (via drill 0.6)
  Top 0.406: v22.81,31.12 22.81,29.08 D6.1 22.2,27.46 22.2,24.94 21.81,24.5 C6.1 19.04,22.48 R5.1 | U1.21 25.1,60.3 24.89,60.63 22.33,63.2 20.4,63.2 v20.14,62.94
  Bottom 0.406: v22.81,31.12 23.75,31.5 23.8,37.85 23.34,38.25 15.54,38.3 15.27,38.63 15.27,47.98 21.13,53.9 21.34,54.15 21.39,58.29 20.14,59.33 v20.14,62.94
AN3  (via drill 0.6)  (1 unrouted)
  Top 0.406: U1.22 24.32,60.19 v21.95,61.09 | D3.1 14.02,25.08 15.14,25.1 | 15.14,25.1 C3.1 | v14.96,26.21 14.94,26.04 15.14,25.1
  Bottom 0.305: 21.04,15.1 22.35,13.87 29.26,13.87 29.44,13.59 29.46,6.93 29.49,6.76 31.12,5.05 67.59,5.05 69.85,7.32 69.85,70.43 69.82,70.46 69.82,70.59 69.04,71.37 13.26,71.37 12.78,70.89 12.78,65.48 14.43,64.03 21.23,64.03 21.69,63.37 21.69,61.34 v21.95,61.09
  Bottom 0.406: v21.95,61.09 21.62,61.34 | R6.1 7.92,17.21 7.92,29.62 8.79,30.23 11.05,30.23 11.84,29.64 11.73,26.92 12.14,26.24 v14.96,26.21
AN4  (via drill 0.6)  (1 unrouted)
  Top 0.406: v20.35,57.81 22.51,57.84 U1.23 | v13.69,19.1 13.66,20.31 13.65,20.52 | 13.65,20.52 12.31,22.72 12.3,24.3 12.34,24.75 12.34,28.75 12.5,28.91 v13.54,28.91 13.39,28.75 | 15.3,20.52 13.65,20.52 | D4.1 11.24,29.71 C9.1 10.02,29.89 U8.3 8.11,29.35 v9.09,28.5 | R1.1 14.68,23.53 v13.77,23.75
  Bottom 0.406: v13.54,28.91 13.54,29.69 14.5,30.4 14.5,48.79 19.94,54.05 20.04,57.18 v20.35,57.81 | v13.69,19.1 15.57,17.22 26.08,17.22 | v13.77,23.75 12.04,23.77 11.76,24.1 9.3,26.57 v9.09,28.5
AN5  (via drill 0.6)  (1 unrouted)
  Top 0.406: v17.86,55.96 17.91,56.01 U1.24 | v1.8,37.41 1.73,37.29 D7.1 3.73,36.65 3.73,35.36 3.84,35.23 C11.1
  Bottom 0.406: 0.64,35.09 0.64,39.85 0.66,40.01 0.74,55.04 2.08,55.96 v17.86,55.96 | R20.1 1.78,35.75 v1.8,37.41
GHT
  Top 0.406: L1.2 64.11,30.28 V1.2 65.09,31.34 D2.C 64.83,34.6 D1.A
GND  (via drill 0.5, 0.6)
  Top 0.305: J1.14 29.45,11.35 34.19,11.35 35.44,10.1 J1.27 | J1.31 39.45,11.35 41.33,11.35 42.58,10.1 J1.39
  Top 0.406: J1.31 J1.27 35.52,10.1 | C12.2 4.08,21.63 4.78,22.33 4.78,24.16 | 4.78,24.16 5.05,24.44 6.5,24.44 6.65,24.59 6.65,25.63 U11.5 | 4.78,24.16 4.61,24.16 C40.2
  Bottom 0.406: J1.2 J1.6 J1.10 J1.14
  other vias: 37.13,33.3 18.9,33.86 10.36,43.05 6.2,18.69 14.91,27.97 9.32,53.47 6.32,28.93
  pour Top: -1.65,77.01 75.31,77.01 75.31,-3.23 -1.65,-3.23
  pour Bottom: -2.21,76.3 76.66,76.3 76.66,-1.57 -2.21,-1.57
N$1
  Top 0.406: S2.3 16.92,69.6 SJ1.2 21.13,68.01 R41.1 22.07,67.68 22.07,69.42 22.34,69.68 R40.1 24.21,70.42 C22.1 28.27,70.6 28.88,71.04 29.59,71.5 44.88,71.5 45.47,71.17 JP9.1
N$2
  Top 0.406: U1.17 28.35,58.71 28.35,61.21 25.6,63.5 L3.1 27.66,67.2 C21.1
N$3  (via drill 0.6)
  Top 0.406: R3.2 33.07,28.51 R17.1 33.18,25.69 U7.1 v34.39,24.56 | v34.49,19.84 34.49,17 J1.21
  Bottom 0.406: v34.39,24.56 v34.49,19.84
N$4
  Top 0.406: C8.A 38.86,55.91 37.87,54.76 36.72,53.61 U1.7
N$5
  Top 0.406: R39.2 35.79,48.83 U1.1
N$6
  Top 0.406: LED1.A 66.93,40.74 R43.1
N$7
  Top 0.406: R17.2 31.5,25.11 U7.2
N$8
  Top 0.406: R41.2 23.35,65.57 24.89,63.93 24.89,63.12 27.51,60.83 27.53,58.65 U1.18
N$9
  Top 0.406: R15.2 8.74,34.85 8.1,34.21 8.1,32.5 U8.4
N$10
  Top 0.406: SJ1.1 15.25,66.02 15.29,62.66 15.27,59.37 U9.1
N$11
  Top 0.406: J1.37 44.28,15.1 47.93,18.75 49.67,18.75 R2.2
N$12
  Top 0.406: JP9.4 37.85,55.85 36.27,54.41 34.3,54.41 U1.8
N$15
  Top 0.406: JP9.5 35.31,65.51 37.01,63.45 37.08,56.26 35.74,55.19 34.31,55.19 U1.9
N$16
  Top 0.406: R7.2 45.65,20.05 J1.33
N$17
  Top 0.406: R8.2 41.68,18.58 J1.29
N$18
  Top 0.406: R9.2 37.49,20.18 37.49,16.89 J1.25
N$19
  Top 0.406: R2.1 50.04,20.98 49.91,21.11 49.91,23.53 U6.1
N$20
  Top 0.406: U2.1 R7.1
N$21
  Top 0.406: U3.1 R8.1
N$22
  Top 0.406: R9.1 37.36,23.61 U5.1
N$24
  Top 0.406: U10.2 25.34,25.46 R18.2
N$25
  Top 0.406: LED3.A R24.1
N$28  (via drill 0.6)
  Top 0.406: R4.2 26.95,28.54 R18.1 27.04,25.41 U10.1 28.42,26.72 v29.18,26.72
  Bottom 0.406: v29.18,26.72 30.3,26.7 35.76,26.72 36.04,26.31 36.04,17.88 34.93,17.27 31.06,17.27 30.7,16.91 J1.17
N$29
  Top 0.406: J1.9 25.7,16.9 24.84,17.75 20.85,17.75 20.14,18.36 20.14,20.71 R5.2
N$31
  Top 0.406: TX2.A 6.65,41.18 6.65,44.01 R27.1
N$32
  Top 0.406: R28.1 3.99,41.23 RX2.A
N$34
  Top 0.406: U8.1 6.21,30.8 5.69,31.37 4.38,31.37 R14.2
N$37
  Top 0.406: R39.1 40.45,46.94 LED7.A
N$39
  Top 0.406: C24.1 7.64,48.43 Y1.3 12.04,47.14 15.65,47.14 18.91,50.41 U1.31
N$40
  Top 0.406: Y1.1 C23.1 | Y1.1 | Y1.1 14.92,51.21 U1.30
N$42
  Top 0.406: R19.2 5.97,27.53 5.64,26.85 5.61,25.72 U11.6
N$44  (1 unrouted)
  Top 0.406: R19.1 7.81,27.8 8.28,26.37 9.66,26.37 R16.2 10.77,25.26 10.77,22.1 9.98,21.31 8.84,21.31 7.55,22.6
N$45  (1 unrouted)
N$50
  Bottom 0.406: R21.2 5.79,10.33 U14.2
N$86
  Top 0.406: TX1.A 51.34,58.84 50.37,57.86 50.37,56.7 R81.1
N$87
  Top 0.406: R82.1 46.34,57.46 RX1.A
RS485-1-A  (via drill 0.6)
  Top 0.406: v48.36,42.85 48.87,43.36 U13.6
  Bottom 0.305: v48.36,42.85 54.99,42.85 55.09,42.7 55.27,42.47 55.27,10.34 53.72,8.84 42.27,8.84 41.06,10.1 J1.35
RS485-1-B  (via drill 0.6)
  Top 0.406: v49.78,40.79 50.06,42.37 50.06,45.85 U13.7
  Bottom 0.305: J1.34 41.27,12.6 42.67,11.35 53.39,11.35 54.23,12.14 54.23,40.72 54.15,40.79 v49.78,40.79
  Bottom 0.406: 49.91,40.97 v49.78,40.79
RS485-2-A  (via drill 0.6)
  Top 0.406: v18.14,28.73 18.24,29.41 U4.6
  Bottom 0.406: v18.14,28.73 48.91,28.75 48.99,16.73 48.08,15.98 48.08,13.93 J1.42
RS485-2-B  (via drill 0.6)
  Top 0.305: 19.43,31.19 19.46,31.17 | J1.43 46.67,10.1 45.39,8.81 42.39,8.81 42.19,8.64 41.94,8.38 41.94,6.45 41.02,5.54 25.88,5.54 24.46,6.96 24.46,13.28 23.8,13.87 18.75,13.87 16.1,15.62 16.1,18.19 v16.51,18.75 | v20.88,25.6 20.88,28.22 19.94,29.24 19.56,29.59 19.53,31.24 U4.7
  Top 0.406: J1.43 46.7,10.12 | 19.43,31.19 U4.7
  Bottom 0.305: v16.51,18.75 20.17,18.75 21.23,19.81 21.29,24.66 v20.88,25.6
RXD1
  Top 0.406: TX1.C 51.89,51.59 U13.1 51.46,51 51.46,50.09 50.98,49.61 U1.2
RXD2  (via drill 0.6)
  Top 0.406: JP1.RXI 53.8,71.4 53.04,72.21 3.51,72.24 2.31,71.09 2.34,40.74 3.23,40.06 5.66,40.06 5.91,39.83 TX2.C 8.27,39.23 10.11,40.82 20.75,40.77 | U4.1 20.75,40.77 | 20.75,40.77 v20.57,40.92 | v40.18,44.22 39.32,45.11 39.27,45.16 31.8,45.16 31.52,45.44 31.52,46.47 U1.43
  Bottom 0.406: v20.57,40.92 25.45,40.95 26.29,40.11 26.37,36.7 27.13,35.61 32.74,35.64 34.57,38.05 40.28,38.05 v40.18,44.22
STOP-A  (via drill 0.6)
  Top 0.406: v5.38,17.02 6.45,14.96 11.79,14.96 12.8,13.94 v15.54,13.94
  Bottom 0.406: R6.2 4.08,14.43 | 4.08,14.43 R21.1 4.11,11.43 U14.1 | 4.08,14.43 4.13,16.66 v5.38,17.02 | v15.54,13.94 16.7,15.1 J1.1
STOP-B  (1 unrouted)
STOP-C
  Bottom 0.406: R20.2 0.71,32.78 0.71,13.41 0.69,13.36 0.69,2.06 1.24,1.47 13.64,1.47 18.19,6.02 18.19,8.94 19.35,10.1 J1.3
TXD1
  Top 0.406: U1.3 44.17,50.41 RX1.C 46.8,50.72 U13.4
TXD2  (via drill 0.6)
  Top 0.406: 16.09,37.38 15.8,37.77 6.58,37.77 4.81,39.03 RX2.C 3.77,38.71 2.9,38.71 1.47,40.13 1.47,71.22 3.2,72.95 56.11,72.95 56.34,72.72 JP1.TXO | 16.09,37.38 U4.4 | U1.44 33.44,47.01 v33.45,46.99 | v16.46,39.29 16.51,37.8 16.09,37.38
  Bottom 0.406: v33.45,46.99 33.45,37.67 32.49,36.58 27.84,36.58 27.79,36.63 27.79,40.31 25.65,42.44 17.83,42.44 16.41,41.02 16.46,39.12 v16.46,39.29
U4  (via drill 0.6)
  Top 0.406: U4.3 18.92,36.5 | 18.92,36.5 U4.2 | U1.5 38.09,52.01 38.56,52.48 v39.37,52.48 | v18.9,39.65 18.9,36.98 18.92,36.5
  Bottom 0.406: v39.37,52.48 39.57,52.45 39.6,52.48 40.16,51.99 41.55,50.6 41.55,37.95 41.05,37.44 35.36,37.41 33.17,34.87 27.1,34.9 25.22,35.76 25.22,39.01 24.54,39.7 19.25,39.7 v18.9,39.65
U13
  Top 0.406: U13.2 49.96,51.03 49.56,51.03 49,51.05 U13.3 48.69,51.23 48.69,52.4 48.64,52.88 46.81,52.88 45.85,51.77 43.33,51.77 43.08,51.21 U1.4
WDI
  Top 0.406: U9.4 20.16,59.73 22.56,59.73 23.27,58.34 23.47,57.91 24.43,55.98 U1.10
WS1
  Top 0.406: U1.42 30.72,45.05 31.37,44.45 35.61,44.45 37.62,43.74 46.51,40.28 46.51,36.83 47.68,35.61 47.65,31.19 48.74,30.2 49.88,30.2 U6.4 50.1,31.14 R13.1
WS2
  Top 0.406: U1.41 29.9,44.91 30.96,43.84 35.48,43.84 45.52,39.95 45.52,35.72 R12.1 | U2.4 45.8,30.4 45.77,30.53 46.56,31.61 R12.1 | 46.66,35.02 R12.1
WS3
  Top 0.406: U1.38 27.52,44.46 29.26,42.47 34.44,42.47 36.22,40.69 36.22,35.66 36.6,35.28 39.88,35.28 | U3.4 40.34,30.18 39.85,30.66 39.85,35.26 39.88,35.28 | R11.1 40.7,36.11 40.32,35.73 39.88,35.28
WS4
  Top 0.406: U1.37 26.72,44.42 28.93,41.86 33.9,41.86 35.2,40.46 35.23,29.98 R10.1 35.21,30.11 U5.4
YO  (via drill 0.6)
  Top 0.406: R14.1 v4.19,28.35 | v4.6,19.79 5.31,19.79 5.49,19.96 5.49,22.92 U11.1
  Bottom 0.406: v4.19,28.35 4.19,20.19 v4.6,19.79

### Text on the board
tPlace: D2 | RJ